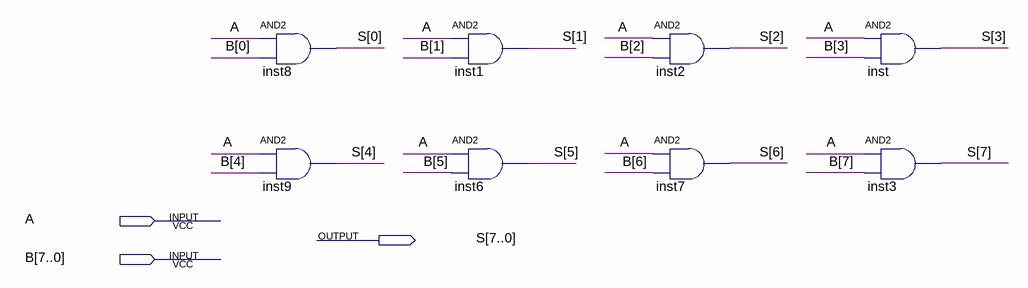
[diagram p0: schematic sheet]
// Quartus schematic AND_8BIT.bdf as structural Verilog: 8 symbols, 3 pins
module AND_8BIT (
  input  A,
  input  [7:0] B,
  output [7:0] S
);

  and inst8 (S[0], A, B[0]);
  and inst9 (S[4], A, B[4]);
  and inst1 (S[1], A, B[1]);
  and inst6 (S[5], A, B[5]);
  and inst2 (S[2], A, B[2]);
  and inst7 (S[6], A, B[6]);
  and inst (S[3], A, B[3]);
  and inst3 (S[7], A, B[7]);
endmodule
